# EAGLE design M161C (EAGLE 6.6.0)
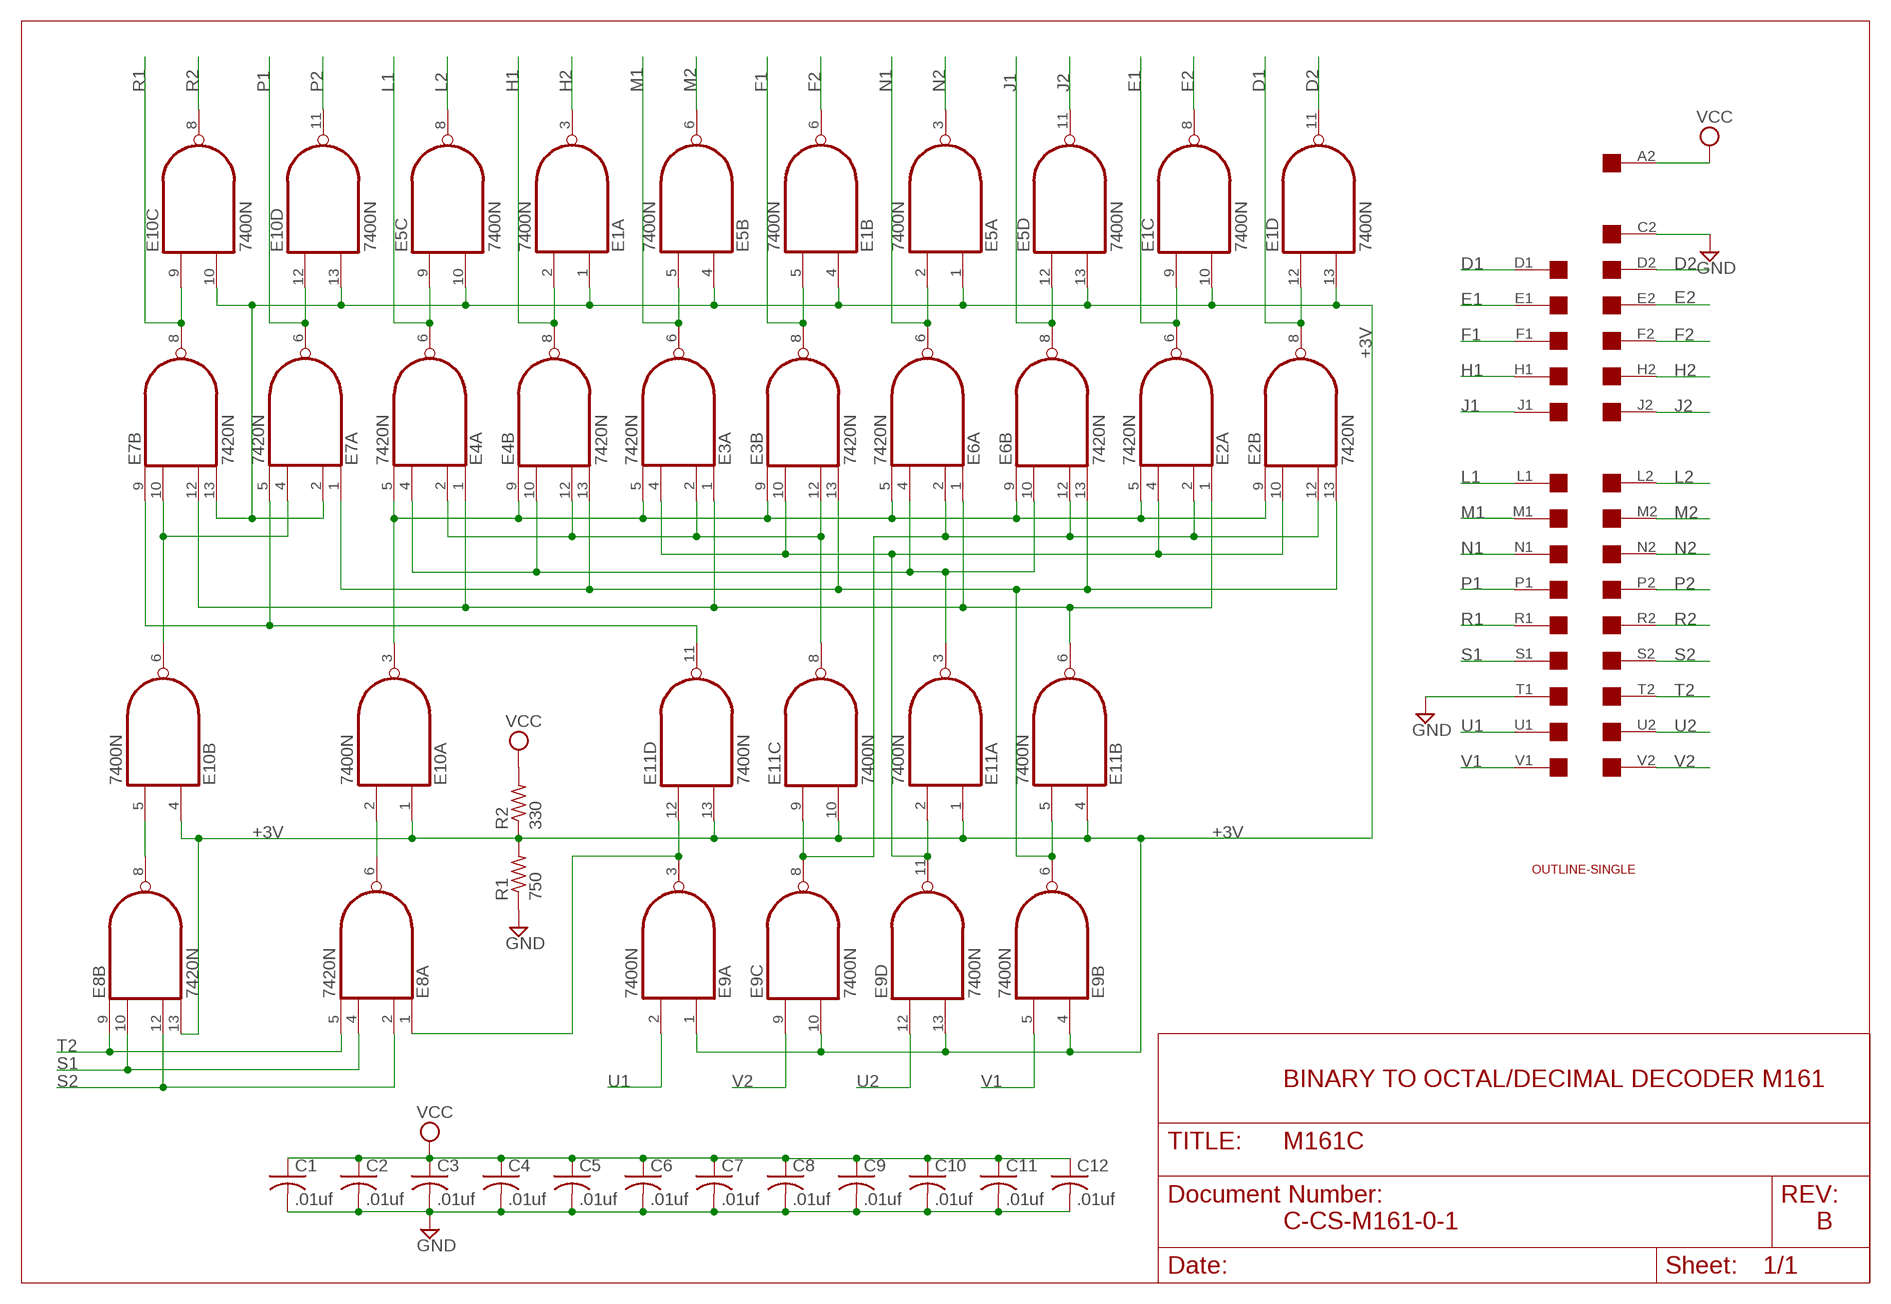
[diagram p0: schematic, sheet 1]

## Parts
C1  .01uf  C-US050-025X075  [C050-025X075]
C2  .01uf  C-US050-025X075  [C050-025X075]
C3  .01uf  C-US050-025X075  [C050-025X075]
C4  .01uf  C-US050-025X075  [C050-025X075]
C5  .01uf  C-US050-025X075  [C050-025X075]
C6  .01uf  C-US050-025X075  [C050-025X075]
C7  .01uf  C-US050-025X075  [C050-025X075]
C8  .01uf  C-US050-025X075  [C050-025X075]
C9  .01uf  C-US050-025X075  [C050-025X075]
C10  .01uf  C-US050-025X075  [C050-025X075]
C11  .01uf  C-US050-025X075  [C050-025X075]
C12  .01uf  C-US050-025X075  [C050-025X075]
E1  7400N  [DIL14]
E2  7420N  74S20N  [DIL14]
E3  7420N  74S20N  [DIL14]
E4  7420N  74S20N  [DIL14]
E5  7400N  [DIL14]
E6  7420N  74S20N  [DIL14]
E7  7420N  74S20N  [DIL14]
E8  7420N  74S20N  [DIL14]
E9  7400N  [DIL14]
E10  7400N  [DIL14]
E11  7400N  [DIL14]
R1  750  R-US_0207/10  [0207/10]
R2  330  R-US_0207/10  [0207/10]
U$1  OUTLINE-SINGLE  [SINGLE]
U$4  SINGLE  [EDGE-CON2]

## Nets
+3V [power]: E1.1(A:I0) E1.4(B:I0) E1.10(C:I1) E1.13(D:I1) E5.1(A:I0) E5.4(B:I0) E5.10(C:I1) E5.13(D:I1) E7.2(A:I1) E7.13(B:I3) E8.13(B:I3) E9.1(A:I0) E9.4(B:I0) E9.10(C:I1) E9.13(D:I1) E10.1(A:I0) E10.4(B:I0) E10.10(C:I1) E10.13(D:I1) E11.1(A:I0) E11.4(B:I0) E11.10(C:I1) E11.13(D:I1) R1.2 R2.1
D1: E1.12(D:I0) E2.8(B:O) U$4.D1
D2: E1.11(D:O) U$4.D2
E1: E1.9(C:I0) E2.6(A:O) U$4.E1
E2: E1.8(C:O) U$4.E2
F1: E1.5(B:I1) E3.8(B:O) U$4.F1
F2: E1.6(B:O) U$4.F2
GND [power]: C1.2 C2.2 C3.2 C4.2 C5.2 C6.2 C7.2 C8.2 C9.2 C10.2 C11.2 C12.2 R1.1 U$4.C2 U$4.T1
H1: E1.2(A:I1) E4.8(B:O) U$4.H1
H2: E1.3(A:O) U$4.H2
J1: E5.12(D:I0) E6.8(B:O) U$4.J1
J2: E5.11(D:O) U$4.J2
L1: E4.6(A:O) E5.9(C:I0) U$4.L1
L2: E5.8(C:O) U$4.L2
M1: E3.6(A:O) E5.5(B:I1) U$4.M1
M2: E5.6(B:O) U$4.M2
N1: E5.2(A:I1) E6.6(A:O) U$4.N1
N2: E5.3(A:O) U$4.N2
N$2: E8.8(B:O) E10.5(B:I1)
N$4: E7.4(A:I2) E7.10(B:I1) E10.6(B:O)
N$5: E2.5(A:I3) E2.9(B:I0) E3.5(A:I3) E3.9(B:I0) E4.5(A:I3) E4.9(B:I0) E6.5(A:I3) E6.9(B:I0) E10.3(A:O)
N$6: E8.6(A:O) E10.2(A:I1)
N$7: E8.1(A:I0) E9.3(A:O) E11.12(D:I0)
N$8: E2.2(A:I1) E2.12(B:I2) E6.2(A:I1) E6.12(B:I2) E9.8(C:O) E11.9(C:I0)
N$9: E2.4(A:I2) E2.10(B:I1) E3.4(A:I2) E3.10(B:I1) E9.11(D:O) E11.2(A:I1)
N$10: E2.13(B:I3) E3.13(B:I3) E4.13(B:I3) E6.13(B:I3) E7.1(A:I0) E9.6(B:O) E11.5(B:I1)
N$11: E3.2(A:I1) E3.12(B:I2) E4.2(A:I1) E4.12(B:I2) E11.8(C:O)
N$12: E7.5(A:I3) E7.9(B:I0) E11.11(D:O)
N$24: E4.4(A:I2) E4.10(B:I1) E6.4(A:I2) E6.10(B:I1) E11.3(A:O)
N$25: E2.1(A:I0) E3.1(A:I0) E4.1(A:I0) E6.1(A:I0) E7.12(B:I2) E11.6(B:O)
P1: E7.6(A:O) E10.12(D:I0) U$4.P1
P2: E10.11(D:O) U$4.P2
R1: E7.8(B:O) E10.9(C:I0) U$4.R1
R2: E10.8(C:O) U$4.R2
S1: E8.4(A:I2) E8.10(B:I1) U$4.S1
S2: E8.2(A:I1) E8.12(B:I2) U$4.S2
T2: E8.5(A:I3) E8.9(B:I0) U$4.T2
U1: E9.2(A:I1) U$4.U1
U2: E9.12(D:I0) U$4.U2
V1: E9.5(B:I1) U$4.V1
V2: E9.9(C:I0) U$4.V2
VCC [power]: C1.1 C2.1 C3.1 C4.1 C5.1 C6.1 C7.1 C8.1 C9.1 C10.1 C11.1 C12.1 R2.2 U$4.A2
Unconnected: U$4.A1 U$4.B1 U$4.B2 U$4.C1 U$4.K1 U$4.K2

## Notes on the sheet
- BINARY TO OCTAL/DECIMAL DECODER M161
- C-CS-M161-0-1 | B

## Power pins joined to a net without a drawn wire
GND: E1.7(P:GND) E2.7(P:GND) E3.7(P:GND) E4.7(P:GND) E5.7(P:GND) E6.7(P:GND) E7.7(P:GND) E8.7(P:GND) E9.7(P:GND) E10.7(P:GND) E11.7(P:GND)
VCC: E1.14(P:VCC) E2.14(P:VCC) E3.14(P:VCC) E4.14(P:VCC) E5.14(P:VCC) E6.14(P:VCC) E7.14(P:VCC) E8.14(P:VCC) E9.14(P:VCC) E10.14(P:VCC) E11.14(P:VCC)

## Library data of the parts
C1-C12 = rcl:C-US: CAPACITOR, American symbol
E1 E5 E9-E11 = 74xx-us:74*00: Quad 2-input NAND gate
E2-E4 E6-E8 = 74xx-us:74*20: Dual 4-input NAND gate
R1 R2 = rcl:R-US_: RESISTOR, American symbol
U$1 = dec-con:OUTLINE-*: Board outlines for DEC boards.
U$4 = dec-con:SINGLE: Single-Height DEC board

## Net classes
0 default: width 0.381 mm
1 power: width 0.813 mm

## Board
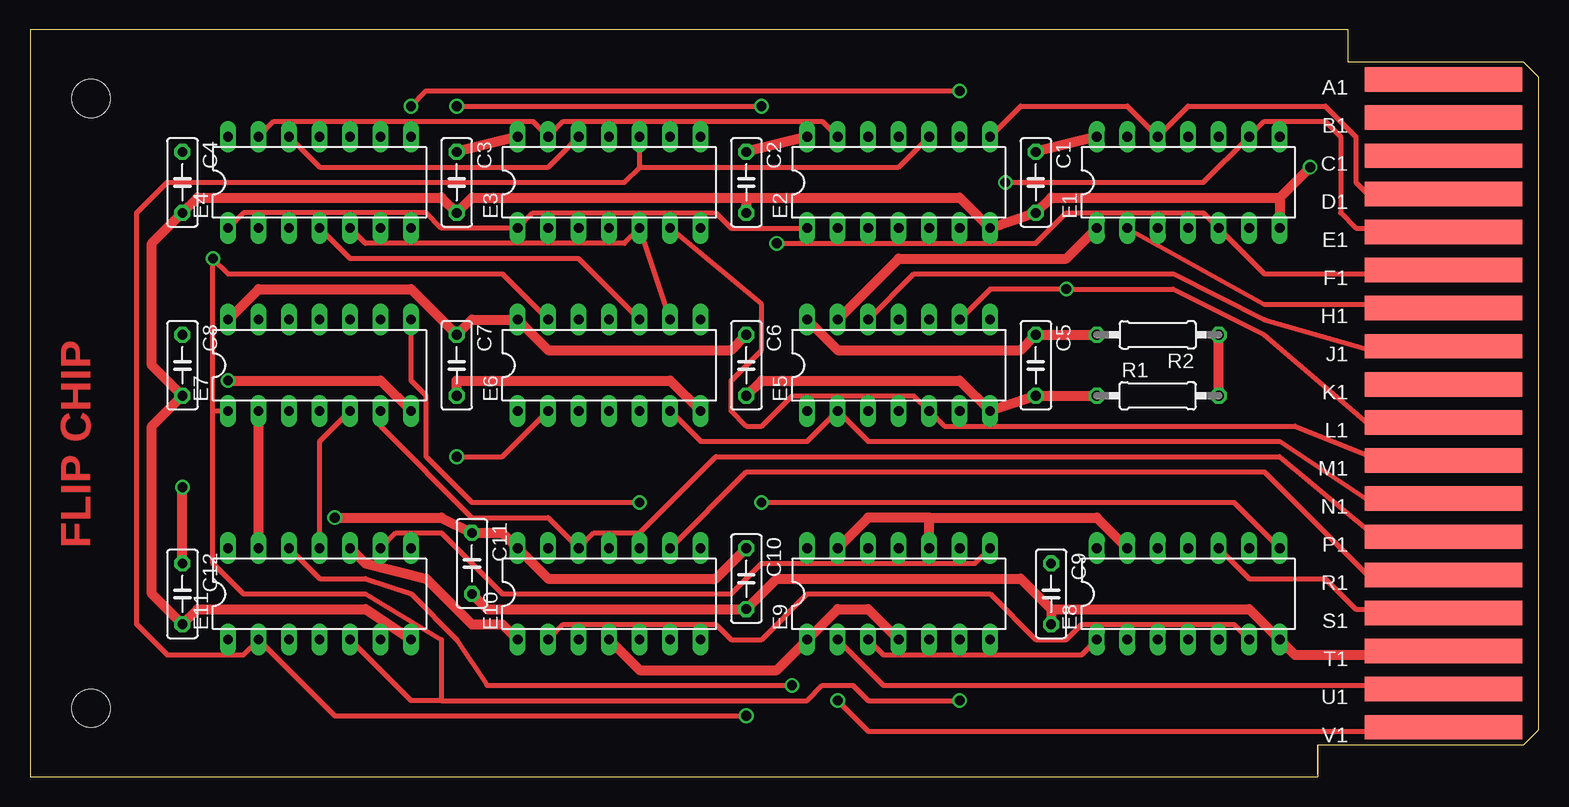
[diagram p1: board, top side]
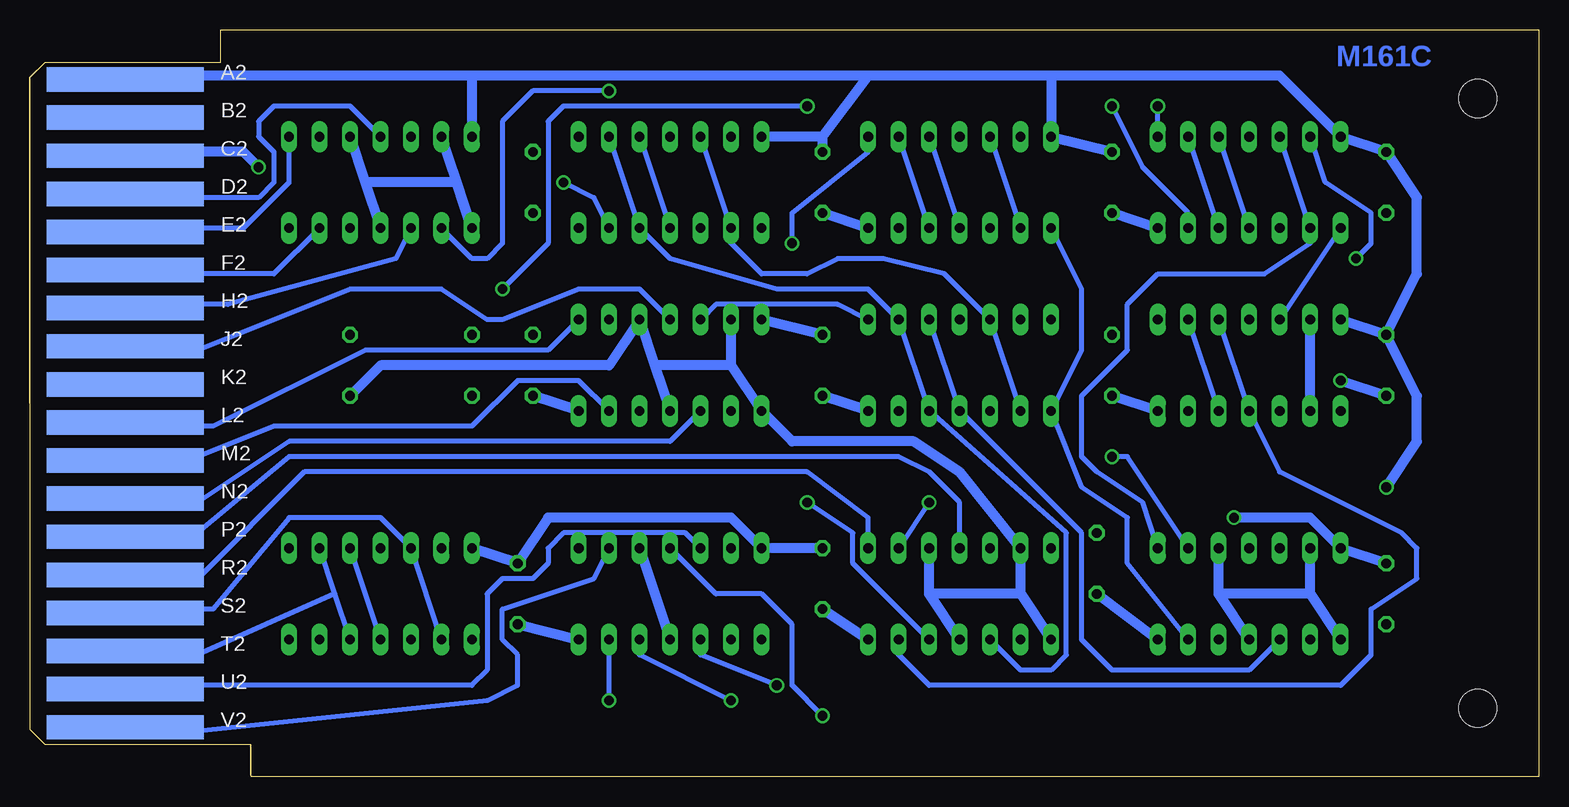
[diagram p2: board, bottom side, seen from below]

Size 125.73 x 62.23 mm. Coordinates in mm from the lower left corner, seen from the top.
Copper layers (1+16): Top 0.035mm / dielectric 1.5mm / Bottom 0.035mm
Design rules "16mils": minimum track width 16mil, minimum drill 32mil, track to track 15mil, track to pad 10mil, pad to pad 10mil, via to via 10mil, smd to smd 10mil, copper to edge 13mil, drill to drill 10mil, minimum pad ring 10mil, minimum via ring 8mil, stop-mask expansion 0mil, vias tented up to drill 0mil, thermal gap 10mil

### Footprints (pad centres in the part's own frame; a part is rotated, then mirrored left to right if it is on the bottom)
C050-025X075 = drill 0.813 octagon: 1 -2.54,0; 2 2.54,0
DIL14 = drill 0.813 long: 1 -7.62,-3.81; 2 -5.08,-3.81; 3 -2.54,-3.81; 4 0,-3.81; 5 2.54,-3.81; 6 5.08,-3.81; 7 7.62,-3.81; 8 7.62,3.81; 9 5.08,3.81; 10 2.54,3.81; 11 0,3.81; 12 -2.54,3.81; 13 -5.08,3.81; 14 -7.62,3.81
0207/10 = drill 0.813 octagon: 1 -5.08,0; 2 5.08,0
SINGLE = hole 3.175: 120.65,56.515; 120.65,5.715
EDGE-CON2 = smd 13.106 x 2.032: A1 7.938,4.128; B1 7.938,7.303; C1 7.938,10.477; D1 7.938,13.652; E1 7.938,16.828; F1 7.938,20.003; H1 7.938,23.177; J1 7.938,26.352; K1 7.938,29.527; L1 7.938,32.703; M1 7.938,35.877; N1 7.938,39.053; P1 7.938,42.227; R1 7.938,45.403; S1 7.938,48.578; T1 7.938,51.752; U1 7.938,54.928; V1 7.938,58.102 | smd 13.106 x 2.032 bottom: A2 7.938,4.128; B2 7.938,7.303; C2 7.938,10.477; D2 7.938,13.652; E2 7.938,16.828; F2 7.938,20.003; H2 7.938,23.177; J2 7.938,26.352; K2 7.938,29.527; L2 7.938,32.703; M2 7.938,35.877; N2 7.938,39.053; P2 7.938,42.227; R2 7.938,45.403; S2 7.938,48.578; T2 7.938,51.752; U2 7.938,54.928; V2 7.938,58.102

### Placement (x,y rotation side)
C1  83.82,49.53 270 top
C2  59.69,49.53 270 top
C3  35.56,49.53 270 top
C4  12.7,49.53 270 top
C5  83.82,34.29 270 top
C6  59.69,34.29 270 top
C7  35.56,34.29 270 top
C8  12.7,34.29 270 top
C9  85.09,15.24 270 top
C10  59.69,16.51 270 top
C11  36.83,17.78 270 top
C12  12.7,15.24 270 top
E1  96.52,49.53 0 top
E2  72.39,49.53 0 top
E3  48.26,49.53 0 top
E4  24.13,49.53 0 top
E5  72.39,34.29 0 top
E6  48.26,34.29 0 top
E7  24.13,34.29 0 top
E8  96.52,15.24 0 top
E9  72.39,15.24 0 top
E10  48.26,15.24 0 top
E11  24.13,15.24 0 top
R1  93.98,31.75 0 top
R2  93.98,36.83 180 top
U$1  125.73,62.23 180 top
U$2  [FLIPCHIP]  0,0 0 top
U$4  125.73,62.23 180 top

### Tracks (layer width: path | path; a pad name or v marks a point on that pad's centre or on a via)
+3V
  Top 0.813: E10.1 39.37,12.7 36.83,12.7 33.02,16.51 27.94,17.78 E11.10 | E9.13 69.85,21.59 74.93,21.59 | E9.10 74.93,21.59 | E8.13 88.9,21.59 74.93,21.59 | R1.2 R2.1 | E5.13 72.39,43.18 86.36,43.18 E1.1 | E10.4 50.8,8.89 62.23,8.89 E9.1 67.31,13.97 69.85,13.97 E9.4 | E11.13 E7.2
  Bottom 0.813: 97.79,49.53 E1.4 | 97.79,49.53 E1.10 | 90.17,49.53 E1.13 | 90.17,49.53 97.79,49.53 | E1.1 90.17,49.53 | R1.2 96.52,34.29 77.47,34.29 E5.10 73.66,34.29 | 73.66,34.29 E5.4 | 67.31,34.29 E5.1 62.23,27.94 52.07,27.94 48.26,25.4 E10.13 43.18,15.24 | 67.31,34.29 73.66,34.29 | 67.31,34.29 E5.13 | E11.1 19.05,15.24 | 26.67,15.24 E11.4 | 26.67,15.24 E11.10 | 19.05,15.24 26.67,15.24 | 19.05,15.24 E11.13 | E10.1 43.18,15.24 | 43.18,15.24 50.8,15.24 | 50.8,15.24 E10.4 | 50.8,15.24 E10.10 | E9.4 E9.10 | E7.2 E7.13
D1
  Top 0.406: U$4.D1 116.84,48.26 111.76,48.26 110.49,49.53 110.49,53.34 107.95,55.88 96.52,55.88 E1.12 91.44,55.88 82.55,55.88 E2.8
D2
  Bottom 0.406: E1.11 99.06,55.88 105.41,55.88 106.68,54.61 106.68,53.34 105.41,52.07 105.41,49.53 106.68,48.26 116.84,48.26 117.14,48.56 U$4.D2
E1  (via drill 0.81)
  Top 0.406: U$4.E1 116.84,45.72 110.49,45.72 109.22,46.99 109.22,53.34 107.95,54.61 102.87,54.61 E1.9 97.79,49.53 v81.28,49.53
  Bottom 0.406: E2.6 78.74,48.26 v81.28,49.53
E2
  Bottom 0.406: U$4.E2 117.17,45.39 116.84,45.72 107.95,45.72 104.14,49.53 E1.8
F1  (via drill 0.81)
  Top 0.406: U$4.F1 116.84,41.91 102.87,41.91 E1.5 97.79,46.99 86.36,46.99 83.82,44.45 v62.23,44.45
  Bottom 0.406: E3.8 55.88,52.07 62.23,46.99 v62.23,44.45
F2
  Bottom 0.406: U$4.F2 117.12,42.19 116.84,41.91 105.41,41.91 E1.6
GND  (via drill 0.81)
  Top 0.813: 85.09,13.97 101.6,13.97 E8.7 105.41,10.16 116.84,10.16 U$4.T1 | E11.7 27.94,13.97 13.97,13.97 C12.2 10.16,15.24 10.16,29.21 C8.2 10.16,34.29 10.16,44.45 C4.2 13.97,48.26 34.29,48.26 C3.2 36.83,48.26 59.69,48.26 | C11.2 38.1,13.97 C10.2 62.23,16.51 82.55,16.51 85.09,13.97 | 85.09,13.97 C9.2 | R1.1 C5.2 E5.7 77.47,33.02 60.96,33.02 C6.2 | 104.14,48.26 85.09,48.26 C1.2 E2.7 77.47,48.26 59.69,48.26 | 104.14,48.26 E1.7 | 104.14,48.26 v106.68,50.8 | 59.69,48.26 C2.2 | v16.51,33.02 29.21,33.02 E7.7 | C7.2 35.56,33.02 53.34,33.02 E6.7
  Bottom 0.813: U$4.C2 117.17,51.74 116.84,52.07 107.95,52.07 v106.68,50.8 | C8.2 v16.51,33.02 | E11.7 C11.2 | C10.2 E10.7 | C9.2 E9.7 | C3.2 E4.7 | E7.7 C7.2 | E6.7 C6.2 | E5.7 C5.2 | C2.2 E3.7
H1  (via drill 0.81)
  Top 0.406: U$4.H1 116.84,39.37 102.87,39.37 E1.2 | v31.75,55.88 33.02,57.15 v77.47,57.15
  Bottom 0.406: E4.8 v31.75,55.88 | E1.2 88.9,43.18 87.63,43.18 86.36,44.45 86.36,54.61 83.82,57.15 v77.47,57.15
H2
  Bottom 0.406: U$4.H2 117.17,39.04 116.84,39.37 109.22,39.37 95.25,43.18 E1.3
J1
  Top 0.406: U$4.J1 116.84,35.56 111.76,35.56 102.87,38.1 95.25,41.91 73.66,41.91 E5.12
  Bottom 0.406: E6.8 58.42,39.37 68.58,39.37 E5.12
J2
  Bottom 0.406: U$4.J2 115.9,35.89 115.57,35.56 111.76,35.56 99.06,40.64 91.44,40.64 87.63,38.1 86.36,38.1 80.01,40.64 74.93,40.64 E5.11
L1  (via drill 0.81)
  Top 0.406: U$4.L1 116.84,29.21 111.76,29.21 102.87,36.83 95.25,40.64 v86.36,40.64 80.01,40.64 E5.9 | v35.56,55.88 v60.96,55.88
  Bottom 0.406: E4.6 29.21,46.99 33.02,50.8 v35.56,55.88 | v86.36,40.64 82.55,44.45 82.55,54.61 81.28,55.88 v60.96,55.88
L2
  Bottom 0.406: U$4.L2 117.76,29.21 110.49,29.21 97.79,35.56 82.55,35.56 E5.8
M1
  Top 0.406: U$4.M1 116.84,26.67 111.76,26.67 105.41,29.21 76.2,29.21 E5.5 73.66,31.75 63.5,31.75 60.96,29.21 59.69,29.21 58.42,30.48 58.42,33.02 60.96,35.56 60.96,39.37 E3.6
M2
  Bottom 0.406: E5.6 80.01,33.02 85.09,33.02 88.9,29.21 105.41,29.21 111.76,26.67 116.84,26.67 U$4.M2
N1
  Top 0.406: U$4.N1 116.84,22.86 111.76,22.86 104.14,27.94 69.85,27.94 E5.2 64.77,27.94 55.88,27.94 E6.6
N2
  Bottom 0.406: U$4.N2 116.84,22.86 111.76,22.86 104.14,27.94 72.39,27.94 E5.3
N$2  (via drill 0.81)
  Top 0.406: v60.96,22.86 100.33,22.86 E8.8
  Bottom 0.406: E10.5 57.15,17.78 57.15,20.32 v60.96,22.86
N$4
  Bottom 0.406: E7.10 E7.4 21.59,25.4 11.43,20.32 10.16,19.05 10.16,16.51 13.97,13.97 13.97,10.16 16.51,7.62 50.8,7.62 53.34,10.16 E10.6
N$5
  Top 0.406: E6.9 E3.5 49.53,44.45 27.94,44.45 E4.5
  Bottom 0.406: E2.9 E2.5 72.39,43.18 63.5,40.64 55.88,40.64 E6.9 E6.5 39.37,20.32 39.37,10.16 40.64,8.89 43.18,8.89 E10.3 | E4.5 E4.9 | E3.5 E3.9
N$6
  Top 0.406: E8.6 100.33,12.7 87.63,12.7 86.36,11.43 83.82,11.43 80.01,15.24 64.77,15.24 60.96,11.43 58.42,11.43 57.15,12.7 44.45,12.7 E10.2
N$7  (via drill 0.81)
  Top 0.406: E8.1 87.63,10.16 71.12,10.16 E9.3 | v63.5,7.62 38.1,7.62 35.56,11.43 31.75,15.24 27.94,16.51 24.13,16.51 E11.12
  Bottom 0.406: E9.3 69.85,10.16 v63.5,7.62
N$8  (via drill 0.81)
  Top 0.406: v35.56,26.67 39.37,26.67 E6.2 | E11.9 30.48,20.32 34.29,20.32 39.37,15.24 58.42,15.24 60.96,17.78 78.74,17.78 E9.8
  Bottom 0.406: E6.2 E6.12 49.53,41.91 54.61,43.18 58.42,43.18 60.96,41.91 64.77,41.91 67.31,44.45 E2.2 E2.12 | E11.9 34.29,26.67 v35.56,26.67
N$9  (via drill 0.81)
  Top 0.406: v59.69,5.08 25.4,5.08 E11.2 17.78,10.16 11.43,10.16 8.89,12.7 8.89,46.99 11.43,49.53 49.53,49.53 50.8,50.8 | 50.8,50.8 E3.10 | 50.8,50.8 72.39,50.8 E2.10
  Bottom 0.406: E2.10 E2.4 | E3.10 E3.4 | E9.11 68.58,15.24 64.77,15.24 62.23,12.7 62.23,7.62 v59.69,5.08
N$10  (via drill 0.81)
  Top 0.406: v77.47,6.35 69.85,6.35 68.58,7.62 66.04,7.62 64.77,6.35 34.29,6.35 | 34.29,6.35 31.75,6.35 E11.5 | 15.24,30.48 v15.24,43.18 16.51,41.91 39.37,41.91 E6.13 | 15.24,30.48 E7.1 | 15.24,30.48 15.24,17.78 17.78,15.24 27.94,15.24 34.29,11.43 34.29,6.35 | E2.13 66.04,54.61 44.45,54.61 E3.13 41.91,54.61 20.32,54.61 E4.13
  Bottom 0.406: v77.47,6.35 E9.6 | E4.13 17.78,49.53 13.97,46.99 13.97,44.45 v15.24,43.18
N$11
  Top 0.406: E3.12 43.18,50.8 24.13,50.8 E4.12
  Bottom 0.406: E4.12 E4.2 19.05,44.45 22.86,41.91 31.75,41.91 34.29,39.37 34.29,35.56 38.1,31.75 38.1,26.67 36.83,25.4 33.02,22.86 E11.8 | E3.12 E3.2
N$12
  Top 0.406: E7.5 24.13,27.94 E11.11
  Bottom 0.406: E7.5 E7.9
N$24
  Top 0.406: E4.4 26.67,43.18 45.72,43.18 E6.10
  Bottom 0.406: E6.10 E6.4 38.1,20.32 38.1,11.43 35.56,8.89 24.13,8.89 E11.3 | E4.4 E4.10
N$25
  Top 0.406: E2.1 58.42,45.72 57.15,46.99 41.91,46.99 E3.1 34.29,45.72 33.02,46.99 17.78,46.99 E4.1
  Bottom 0.406: E11.6 34.29,17.78 34.29,21.59 38.1,24.13 E6.1 38.1,35.56 38.1,40.64 E3.1 | E4.1 E7.12
P1
  Top 0.406: U$4.P1 116.84,20.32 111.76,20.32 104.14,26.67 57.15,26.67 50.8,20.32 46.99,20.32 E10.12 43.18,21.59 36.83,21.59 29.21,29.21 E7.6
P2
  Bottom 0.406: U$4.P2 116.84,20.32 111.76,20.32 104.14,26.67 53.34,26.67 50.8,25.4 48.26,22.86 E10.11
R1  (via drill 0.81)
  Top 0.406: U$4.R1 116.84,16.51 111.76,16.51 102.87,25.4 59.69,25.4 E10.9 | v50.8,22.86 36.83,22.86 33.02,26.67 33.02,31.75 31.75,33.02 E7.8
  Bottom 0.406: v50.8,22.86 E10.9
R2
  Bottom 0.406: U$4.R2 116.84,16.51 111.76,16.51 102.87,25.4 60.96,25.4 55.88,21.59 E10.8
S1
  Top 0.406: U$4.S1 116.84,13.97 110.49,13.97 107.95,16.51 101.6,16.51 E8.10
  Bottom 0.406: E8.4 E8.10
S2
  Bottom 0.406: E8.2 E8.12 96.52,21.59 104.14,21.59 110.49,13.97 116.84,13.97 U$4.S2
T2
  Bottom 0.406: E8.5 100.33,15.24 | 100.33,15.24 E8.9 | U$4.T2 116.84,10.16 111.76,10.16 100.33,15.24
U1
  Top 0.406: U$4.U1 116.84,7.62 71.12,7.62 E9.2
U2
  Bottom 0.406: U$4.U2 116.84,7.62 88.9,7.62 87.63,8.89 87.63,15.24 86.36,16.51 83.82,16.51 82.55,17.78 82.55,19.05 81.28,20.32 71.12,20.32 E9.12
V1  (via drill 0.81)
  Top 0.406: U$4.V1 114.69,4.2 114.3,3.81 69.85,3.81 v67.31,6.35
  Bottom 0.406: E9.5 74.93,10.16 v67.31,6.35
V2
  Bottom 0.406: U$4.V2 116.84,3.81 111.76,3.81 87.63,6.35 85.09,7.62 85.09,10.16 86.36,11.43 86.36,13.97 78.74,16.51 E9.9
VCC  (via drill 0.81)
  Top 0.813: C12.1 v12.7,24.13 | v25.4,21.59 34.29,21.59 C11.1 39.37,20.32 E10.14 43.18,16.51 57.15,16.51 C10.1 | E7.14 19.05,40.64 31.75,40.64 C7.1 36.83,38.1 E6.14 43.18,35.56 58.42,35.56 C6.1 | R2.2 C5.1 82.55,35.56 67.31,35.56 E5.14 | E1.14 C1.1 | E2.14 C2.1 | E3.14 C3.1
  Bottom 0.813: U$4.A2 117.24,58.02 116.84,58.42 88.9,58.42 | 40.64,58.42 21.59,58.42 E4.14 C4.1 10.16,48.26 10.16,41.91 C8.1 | 40.64,58.42 55.88,58.42 | 55.88,58.42 88.9,58.42 | 40.64,58.42 E3.14 C3.1 | 59.69,53.34 E2.14 | 59.69,53.34 C2.1 | 55.88,58.42 59.69,53.34 | 88.9,58.42 E1.14 | E8.14 C9.1 82.55,21.59 67.31,21.59 E9.14 C10.1 | C12.1 E11.14 19.05,21.59 v25.4,21.59 | C8.1 E7.14 | C8.1 10.16,31.75 10.16,27.94 v12.7,24.13 | C6.1 E5.14

### Text on the board
Bottom: M161C